# Altium project XBee_Explorer_Dongle.PrjPcb
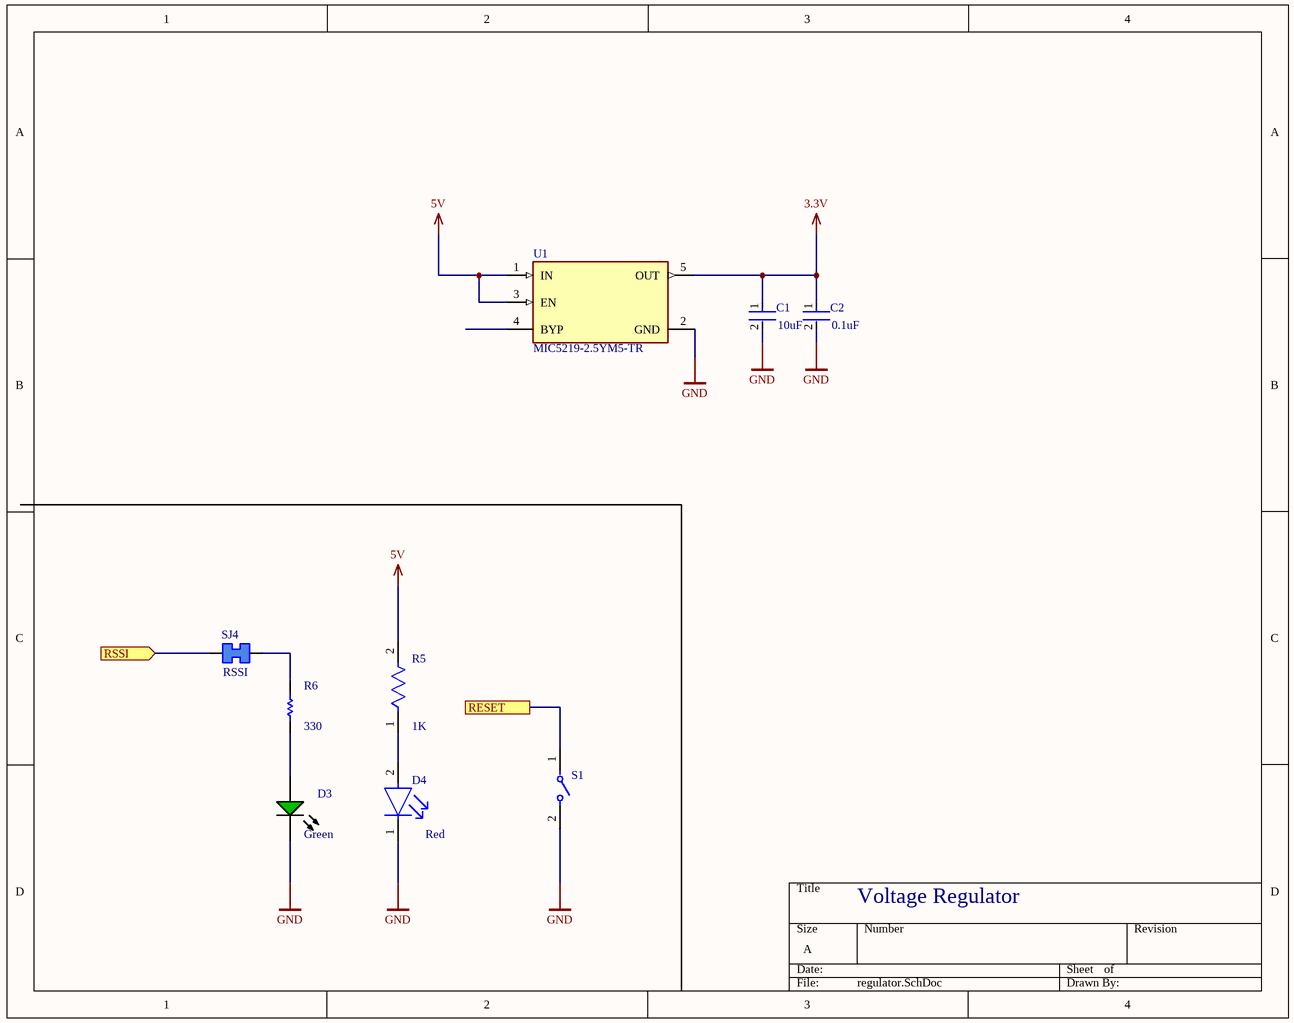
[diagram p0: regulator.SchDoc]
3 sheets, 29 parts. Net scope: flat (ports and power ports of the same name join across sheets).
Board file: PCB.PcbDoc
Sheets:
  regulator.SchDoc
  USB.SchDoc
  Xbee.SchDoc

## Sheet regulator.SchDoc
size A; SheetNumber: 1; SheetTotal: 3

### Parts
C1  10uF  [FP-GRM188-0_1-e0_2_0_55-IPC_A]
C2  0.1uF  [FP-C0402-BB-MFG]
D3  Green  [AVAG-HSMX-C170_V]
D4  Red  [FP-HSMS-C150-MFG]
R5  1K  [FP-ERJ1GN-IPC_C]
R6  330  [RESC0603X26X15ML03T05]
S1  (no value)  [FP-B3F-6022-MFG]
SJ4  RSSI  [Solder Jumper-Footprint-1]
U1  MIC5219-2.5YM5-TR  [FP-SOT23-5LD-PL-1-MFG]

### Ports
RESET, RSSI (in)

### Nets
3.3V: C1.1 C2.1 U1.5(OUT)
5V: R5.2 U1.1(IN) U1.3(EN)
GND: C1.2 C2.2 D3.2(K) D4.1(C) S1.2 U1.2(GND)
NetD3_1: D3.1(A) R6.2
NetD4_2: D4.2(A) R5.1
NetR6_1: R6.1 SJ4.2
NetS1_1: S1.1 ; port RESET
NetSJ4_1: SJ4.1 ; port RSSI

Not connected (* = marked no-connect by the designer): U1 4(BYP)

### Notes on the sheet
- Voltage Regulator

### Library data of the parts
C1 = CMP-2006-02792-2: Chip Multilayer Ceramic Capacitors for General Purpose, 0603, 10uF, X5R, 15%, 20%, 6.3V; Packaging: Tape and Reel; Voltage Rating (DC): 6.3V; Width: 0.031inch; Termination: SMD/SMT; Dielectric: X5R; Package Quantity: 4000; Voltage Rating: 6.3V; Capacitance: 10uF; Case/Package: 0603; Min Operating Temperature: -55°C; Voltage: 6.3V; Length: 1.6mm; Thickness: 0.035inch; Lead Free: Lead Free; Depth: 0.8mm; Case Code (Imperial): 0603; Max Operating Temperature: 85°C; Material: Ceramic; Height: 0.8mm; Tolerance: 20%; Mount: Surface Mount; REACH SVHC: No SVHC; Radiation Hardening: No; Case Code (Metric): 1608
C2 = CMP-2008-02046-2: CAP CER 0.1UF 10V X5R 0402; Manufacturer: Kemet; Manufacturer Part Number: C0402C104K8PACTU; Material: Ceramic; Capacitance: 0.10 μF; Temperature Coefficient: 15%; Tolerance: 0.1; Value: 0.10 μF; Package: C0402-BB; Temperature: -55°C to +125°C; ComponentLink2Description: Datasheet; Temperature Characteristic: X5R; Device Class L1: Passive Components; Height: 0.55mm; Lead Free: Yes; ComponentLink2URL: https://content.kemet.com/datasheets/KEM_C1002_X7R_SMD.pdf; Device Class L2: Capacitors; Temperature Range Low: -55°C; Temperature Range High: +125°C; RoHS: TRUE; Octopart: https://octopart.com/c0402c104k8pactu-kemet-140039; Automotive: No; Mouser Description: Capacitor 100 nF 10 VDC 0402; Category: Cap; Voltage Rating: 10 V; Digikey Description: CAP CER 0.1UF 10V X5R 0402; Ipc Land Pattern Name: CAPC10050X50; Device Class L3: Ceramic Capacitors
D3 = CMP-2000-05062-1: Chip LED, Green, 2.2 V, -40 to 85 degC, 2-Pin SMD, Pb-Free, Tape and Reel; Manufacturer: Avago; No. of Pins: 2; Peak Wavelength: 570nm; SVHC: NoSVHC(16-Jun-2014); Dominant Wavelength: 572nm; Forward Current If: 20mA; Viewing Angle: 170deg; Lens Shape: Rectangular; PIV Max: 5V; External Width: 1.25mm; LED Type: Standard; External Depth: 0.8mm; Opto Mounting Orientation: Top; Luminous Intensity: 15mcd; Luminous Intensity Min: 4mcd; Forward Voltage VF Max: 2.6V; External Length / Height: 2mm; Bulb Size: 1.25mmx1.4mm; Light Area Height: 1mm; Voltage Vf Typ: 2.2V; Operating Temperature Max: 85degC; Datasheet Version: Oct-08; MSL: MSL2A-4weeks; Peak Forward Current: 20mA; Package Description: 2-Pin Surface Mount Device, Body 2 x 1.25 mm, Height 0.8 mm; Datasheet URL: https://datasheet.ciiva.com/29280/180495-da-01-en-chip-led-hsmg-c170-gelb-gruen-29280971.pdf; Storage Temperature Min: -40degC; LED Colour: Green; Wavelength Typ: 570nm; Mounting Type: SMD; Forward Current If Max: 20mA; Dominant Wavelength Typ: 572nm; LED Mounting: SMD; Operating Temperature Range: -30degCto+85degC; Operating Temperature Min: -30degC; Manufacturer URL: http://www.avagotech.com/; Packaging: CutTape; Luminous Intensity Typ: 15mcd; Package Reference: HSMX-C170; Storage Temperature Max: 85degC; Opto Case Style: SMD; Forward Voltage: 2.2V
D4 = CMP-21615-000001-1: LED RED DIFFUSED CHIP SMD; Luminous Intensity: 10mcd; Power Dissipation: 65mW; Viewing Angle: 170°; Number of Elements: 1; Forward Current: 20mA; Lens Color: White; Lens Style: Rectangular; Wavelength: 626nm; Forward Voltage: 2.1V; Reverse Voltage: 5V; Number of Pins: 2; Color: Red; Lead Free: Lead Free; Width: 1.6mm; Length: 3.2mm; REACH SVHC: No SVHC; Height: 1.1mm; Depth: 1.6mm; Power Rating: 65mW; Package Quantity: 1; Illumination Color: Red; Radiation Hardening: No; Case Code (Imperial): 1206; Max Operating Temperature: 85°C; Test Current: 20mA; Case/Package: 1206; Lens Transparency: Diffused; Number of LEDs: 1; Packaging: Tape and Reel; Mount: Surface Mount; Min Operating Temperature: -40°C; Case Code (Metric): 3216; Dominant Wavelength: 626nm
R5 = CMP-1010-00416-3: RES SMD 1K OHM 1% 1/20W 0201; Temperature Coefficient: 200ppm/°C; Max Power Dissipation: 50mW; Voltage Rating (DC): 25V; Resistance: 1kR; Number of Pins: 2; Height: 0.01inch; Weight: 6E-06oz; Min Operating Temperature: -55°C; Features: Automotive AEC-Q200; Radiation Hardening: No; Resistor Type: Thick Film; RoHS Compliant: Yes; Termination: SMD/SMT; Package Quantity: 15000; Size Code: 0201; Case Code (Imperial): 0201; Resistance Tolerance: 1%; Contact Plating: Tin; Case/Package: 0201; Lead Free: Lead Free; Number of Terminations: 2; Tolerance: 1%; Max Operating Temperature: 125°C; Mount: Surface Mount; Width: 0.012inch; Series: ERJ; Voltage Rating: 25V; Power Rating: 50mW; Packaging: Tape and Reel; Length: 0.6mm; Case Code (Metric): 0603
R6 = CMP-2004-03502-1: Part Number: ERJ1GNF3300C; Manufacturer: Panasonic
S1 = CMP-08834-000012-1: SWITCH TACTILE SPST-NO 0.05A 24V; Switch Travel: 0.25mm; Actuator Type: Standard; Mechanical Life: 300000Cycles; Switch Function: Off-Mom; Illumination Type: Non-Illuminated; Operating Force: 1.47N; Throw Configuration: SPST; Case/Package: Radial; Contact Plating: Gold; Termination: PC Pins; Max Voltage Rating (DC): 24V; Packaging: Ammo Pack; Min Operating Temperature: -25°C; Mount: Through Hole; Package Quantity: 1000; Max Operating Temperature: 70°C
SJ4 = CMP-00030-00001-2: 2 pad Solder Jumper
U1 = CMP-00252-66802246-1: MIC5219-2.5YM5-TR LDO Regulator Pos 2.5V 0.5A 5-Pin SOT-23 T/R; Max Junction Temperature (Tj): 125°C; Dropout Voltage: 350mV; Output Type: Fixed; Accuracy: 1%; Number of Regulators: 1; Max Input Voltage: 12V; Output Current: 500mA; Min Supply Voltage: 3.5V; Polarity: Positive; Packaging: Tape and Reel; Height: 1.1mm; RoHS: Compliant; NexarPartId: 66802246; Number of Pins: 5; Lifecycle Status: Production; Lead Free: Lead Free; Output Voltage Accuracy: 1%; Schedule B: 8542390000; Case/Package: SOT-23; Output Voltage: 2.5V; REACH SVHC: No SVHC; Max Operating Temperature: 125°C; Mount: Surface Mount; Width: 1.6mm; Nominal Output Voltage: 2.5V; Min Input Voltage: 2.5V; Length: 2.9mm; Min Output Voltage: 2.5V; Max Supply Voltage: 12V; Ambient Temperature Range High: 125°C; Number of Outputs: 1; Min Operating Temperature: -40°C; Max Output Current: 500mA

## Sheet USB.SchDoc
size A; SheetNumber: 2; SheetTotal: 3
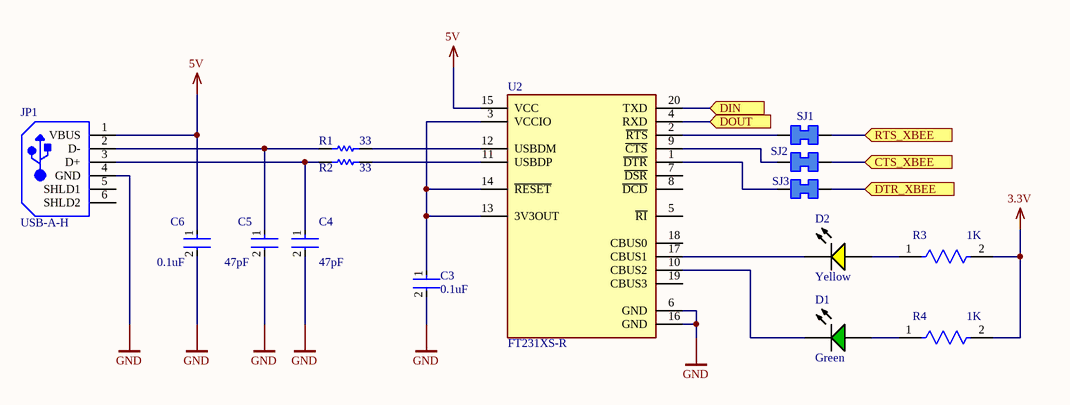
[diagram p1: USB.SchDoc]

### Parts
C3  0.1uF  [FP-C0402-BB-MFG]
C4  47pF  [FP-C0805C-DN-MFG]
C5  47pF  [FP-C0805C-DN-MFG]
C6  0.1uF  [FP-C0402-BB-MFG]
D1  Green  [AVAG-HSMX-C170_V]
D2  Yellow  [AVAG-HSMX-C190_V]
JP1  USB-A-H  [TE-292303-1_V]
R1  33  [RESC0603X26X15ML03T05]
R2  33  [RESC0603X26X15ML03T05]
R3  1K  [FP-ERJ1GN-IPC_C]
R4  1K  [FP-ERJ1GN-IPC_C]
SJ1  Solder Jumper  [Solder Jumper-Footprint-1]  (value not drawn)
SJ2  Solder Jumper  [Solder Jumper-Footprint-1]  (value not drawn)
SJ3  Solder Jumper  [Solder Jumper-Footprint-1]  (value not drawn)
U2  FT231XS-R  [FP-SSOP-20-MFG]

### Ports
CTS_XBEE (in), DIN (in), DOUT (in), DTR_XBEE (in), RTS_XBEE (in)

### Nets
3.3V: R3.2 R4.2
5V: C6.1 JP1.1(VBUS) U2.15(VCC)
GND: C3.2 C4.2 C5.2 C6.2 JP1.4(GND) U2.6(GND) U2.16(GND)
NetC3_1: C3.1 U2.3(VCCIO) U2.13(3V3OUT) U2.14(~{RESET})
NetC4_1: C4.1 JP1.3(D+) R2.1
NetC5_1: C5.1 JP1.2(D-) R1.1
NetD1_1: D1.1(A) R4.1
NetD1_2: D1.2(K) U2.10(CBUS2)
NetD2_1: D2.1(A) R3.1
NetD2_2: D2.2(K) U2.17(CBUS1)
NetR1_2: R1.2 U2.12(USBDM)
NetR2_2: R2.2 U2.11(USBDP)
NetSJ1_1: SJ1.1 U2.2(~{RTS})
NetSJ1_2: SJ1.2 ; port RTS_XBEE
NetSJ2_1: SJ2.1 U2.9(~{CTS})
NetSJ2_2: SJ2.2 ; port CTS_XBEE
NetSJ3_1: SJ3.1 U2.1(~{DTR})
NetSJ3_2: SJ3.2 ; port DTR_XBEE
NetU2_4: U2.4(RXD) ; port DOUT
NetU2_20: U2.20(TXD) ; port DIN

Not connected (* = marked no-connect by the designer): JP1 5(SHLD1) 6(SHLD2); U2 5(~{RI}) 7(~{DSR}) 8(~{DCD}) 18(CBUS0) 19(CBUS3)

### Library data of the parts
C3 C6 = CMP-2008-02046-2: as C2 on sheet regulator; Package: C0402-BB; Temperature: -55°C to +125°C; ComponentLink2Description: Datasheet; Temperature Characteristic: X5R; Device Class L1: Passive Components; Height: 0.55mm; Lead Free: Yes; ComponentLink2URL: https://content.kemet.com/datasheets/KEM_C1002_X7R_SMD.pdf; Device Class L2: Capacitors; Temperature Range Low: -55°C; Temperature Range High: +125°C; RoHS: TRUE; Octopart: https://octopart.com/c0402c104k8pactu-kemet-140039; Automotive: No; Mouser Description: Capacitor 100 nF 10 VDC 0402; Category: Cap; Voltage Rating: 10 V; Digikey Description: CAP CER 0.1UF 10V X5R 0402; Ipc Land Pattern Name: CAPC10050X50; Device Class L3: Ceramic Capacitors
C4 C5 = CMP-2007-00435-2: CAP CER 47PF 50V C0G/NP0 0805; Manufacturer: KEMET; Manufacturer Part Number: C0805C470J5GACTU; Temperature Characteristic: C0G; Material: Ceramic; Temperature Coefficient: 30ppm/°C; Tolerance: 0.05; Temperature Range High: +125°C; Device Class L1: Passive Components; Device Class L3: Ceramic Capacitors; Lead Free: Yes; Temperature: -55°C to +125°C; Capacitance: 47 pF; Height: 0.88mm; Octopart: https://octopart.com/c0805c470j5gactu-kemet-150274; RoHS: TRUE; Category: Cap; Voltage Rating: 50 V; Automotive: No; Device Class L2: Capacitors; Value: 47 pF; Ipc Land Pattern Name: CAPC200125X78; Temperature Range Low: -55°C; Mouser Description: Multilayer Ceramic Capacitors MLCC - SMD/SMT 50volts 47pF C0G 5%; Package: C0805C-DN; Digikey Description: CAP CER 47PF 50V C0G/NP0 0805; ComponentLink2URL: https://content.kemet.com/datasheets/KEM_C1003_C0G_SMD.pdf; ComponentLink2Description: Datasheet
D1 = CMP-2000-05062-1: as D3 on sheet regulator; Operating Temperature Max: 85degC; Datasheet Version: Oct-08; MSL: MSL2A-4weeks; Peak Forward Current: 20mA; Package Description: 2-Pin Surface Mount Device, Body 2 x 1.25 mm, Height 0.8 mm; Datasheet URL: https://datasheet.ciiva.com/29280/180495-da-01-en-chip-led-hsmg-c170-gelb-gruen-29280971.pdf; Storage Temperature Min: -40degC; LED Colour: Green; Wavelength Typ: 570nm; Mounting Type: SMD; Forward Current If Max: 20mA; Dominant Wavelength Typ: 572nm; LED Mounting: SMD; Operating Temperature Range: -30degCto+85degC; Operating Temperature Min: -30degC; Manufacturer URL: http://www.avagotech.com/; Packaging: CutTape; Luminous Intensity Typ: 15mcd; Package Reference: HSMX-C170; Storage Temperature Max: 85degC; Opto Case Style: SMD; Forward Voltage: 2.2V
D2 = CMP-1744-00003-1: LED Uni-Color Yellow, 65 mW, 20 mA, -40 to 85 degC, 2-Pin SMD, RoHS, Tape and Reel; Tolerance: 1%; Voltage Rating: 50 V; Power Rating: 100 mW; Case\Package: 0603; Resistance: 390 Ohm; Min Operating Temperature: -55 degC; Length: 1.6 mm; ComponentLink3Description: Package Specification; Mount: Surface Mount; PackageReference: HSMX-C190; ComponentLink2Description: Datasheet; DatasheetVersion: Mar-12; Case Code (Metric): 1608; Pins: 2; Package Quantity: 5000; ComponentLink2URL: http://docs.avagotech.com/docs/AV02-0551EN; ComponentLink1Description: Manufacturer URL; RoHSCompliant: true; Packaging: Tape and Reel; PackageDescription: 2-Pin Surface Mount Device, Body 1.6 x 0.8 mm, Height 0.9 mm; REACH SVHC: No SVHC; ComponentLink3URL: http://www.fairchildsemi.com/dwg/MA/MA03D.pdf; Voltage Rating (DC): 50 V; Width: 0.8 mm; ComponentLink1URL: http://www.avagotech.com/; Max Operating Temperature: 155 degC; Case Code (Imperial): 0603; Height: 0.45 mm
JP1 = CMP-2000-05404-1: 1 Port Right Angle Through Hole Mount Female Type A USB Connector, 4 Position, -55 to 85 degC, RoHS, Tube; Manufacturer: TE Connectivity; Contact Termination Type: Solder; No. of Contacts: 4; Connector Mounting: PCB; SVHC: NoSVHC(16-Jun-2014); Gender: Receptacle; Connector Type: USBA; Package Description: 4-Pin Through Hole Device, Body 14 x 13.13 mm, Pitch 2.5 mm; Contact Plating: Gold; Package Reference: 292303-1; Contact Material: Copper; Datasheet URL: http://www.farnell.com/cad/1653030.pdf; Datasheet Version: Feb-12; Manufacturer URL: http://www.te.com/
R1 R2 = CMP-2004-03506-1: Manufacturer: Panasonic; Part Number: ERJ1GNF33R0C
R3 R4 = CMP-1010-00416-3: as R5 on sheet regulator; Number of Pins: 2; Height: 0.01inch; Weight: 6E-06oz; Min Operating Temperature: -55°C; Features: Automotive AEC-Q200; Radiation Hardening: No; Resistor Type: Thick Film; RoHS Compliant: Yes; Termination: SMD/SMT; Package Quantity: 15000; Size Code: 0201; Case Code (Imperial): 0201; Resistance Tolerance: 1%; Contact Plating: Tin; Case/Package: 0201; Lead Free: Lead Free; Number of Terminations: 2; Tolerance: 1%; Max Operating Temperature: 125°C; Mount: Surface Mount; Width: 0.012inch; Series: ERJ; Voltage Rating: 25V; Power Rating: 50mW; Packaging: Tape and Reel; Length: 0.6mm; Case Code (Metric): 0603
SJ1-SJ3 = CMP-00030-00001-2: 2 pad Solder Jumper
U2 = CMP-0248-00024-3: IC USB SERIAL FULL UART 20SSOP; Operating Supply Voltage: 5V; Operating Supply Current: 8mA; Number of Channels: 1; Min Supply Voltage: 2.97V; Max Supply Voltage: 5.5V; Data Rate: 12Mbps; Height: 0.059inch; Packaging: Tape and Reel; Mount: Surface Mount; Package Quantity: 2000; Radiation Hardening: No; Case/Package: SSOP; Min Operating Temperature: -40°C; Width: 0.157inch; Number of Pins: 20; Weight: 0.016oz; Interface: UART; Max Operating Temperature: 85°C; Length: 8.74mm

## Sheet Xbee.SchDoc
size A; SheetNumber: 3; SheetTotal: 3
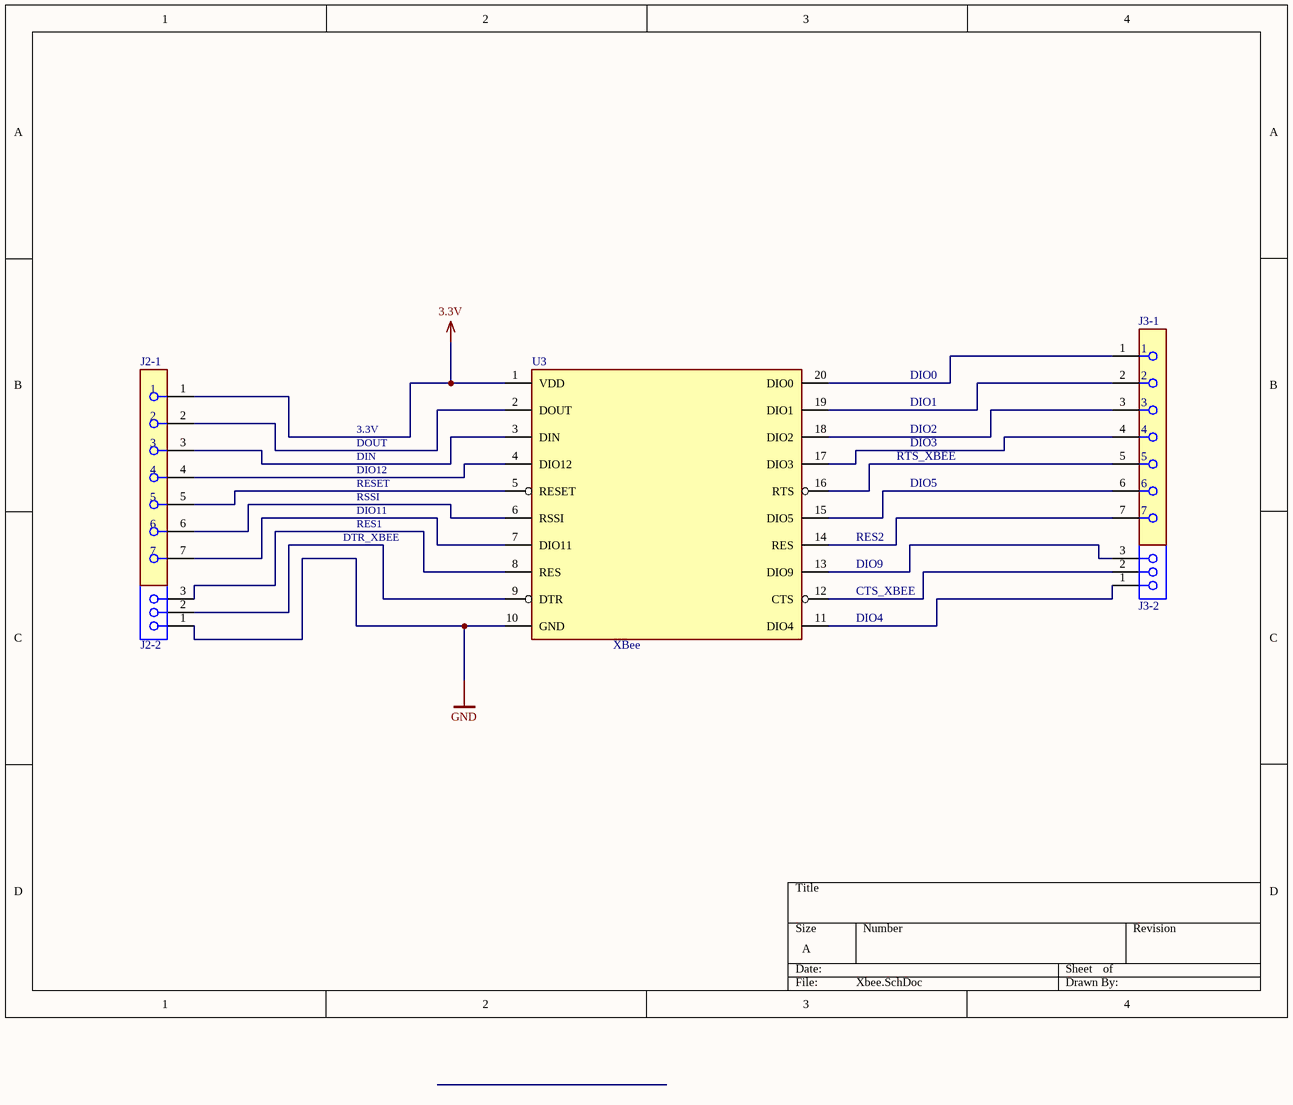
[diagram p2: Xbee.SchDoc]

### Parts
J2-1  SSM-107-L-SV-BE  [FP-SSM-107-L-SV-BE-MFG]  (value not drawn)
J2-2  SSM-103-L-SV  [SMTC-SSM-103-X-SV]  (value not drawn)
J3-1  SSM-107-L-SV-BE  [FP-SSM-107-L-SV-BE-MFG]  (value not drawn)
J3-2  SSM-103-L-SV  [SMTC-SSM-103-X-SV]  (value not drawn)
U3  XBee  [FP-XBP9B-DMUTB002-MFG]

### Nets
3.3V: J2-1.1 U3.1(VDD)
GND: J2-2.1 U3.10(GND)
NetJ2-1_2: J2-1.2 U3.2(DOUT)
NetJ2-1_3: J2-1.3 U3.3(DIN)
NetJ2-1_4: J2-1.4 U3.4(DIO12)
NetJ2-1_5: J2-1.5 U3.5(RESET)
NetJ2-1_6: J2-1.6 U3.6(RSSI)
NetJ2-1_7: J2-1.7 U3.7(DIO11)
NetJ2-2_2: J2-2.2 U3.9(DTR)
NetJ2-2_3: J2-2.3 U3.8(RES)
NetJ3-1_1: J3-1.1 U3.20(DIO0)
NetJ3-1_2: J3-1.2 U3.19(DIO1)
NetJ3-1_3: J3-1.3 U3.18(DIO2)
NetJ3-1_4: J3-1.4 U3.17(DIO3)
NetJ3-1_5: J3-1.5 U3.16(RTS)
NetJ3-1_6: J3-1.6 U3.15(DIO5)
NetJ3-1_7: J3-1.7 U3.14(RES)
NetJ3-2_1: J3-2.1 U3.11(DIO4)
NetJ3-2_2: J3-2.2 U3.12(CTS)
NetJ3-2_3: J3-2.3 U3.13(DIO9)

### Notes on the sheet
- 3.3V
- DIO0
- DIO1
- DIO2
- DOUT
- DIN
- DIO12
- RESET
- RSSI
- RTS_XBEE
- DIO3
- DIO5
- DTR_XBEE
- DIO11
- RES1
- RES2
- DIO9
- CTS_XBEE
- DIO4

### Library data of the parts
J2-1 J3-1 = CMP-02766-001731-1: CONN RCPT 7POS 0.1 GOLD SMD; Connector Type: Receptacle; Max Current Rating: 6.9A; Number of Positions: 7; Pitch: 2.54mm; Voltage Rating (AC): 405V; Voltage Rating (DC): 572V; Max Voltage Rating (AC): 475V; Contact Resistance: 10mR; Gender: Female; Series: SSM; Max Operating Temperature: 125°C; Number of Rows: 1; Contact Finish - Mating: GOLD; Radiation Hardening: No; Housing Color: Black; Orientation: Straight; Min Operating Temperature: -55°C; Length: 17.78mm; RoHS Compliant: Yes; Termination: Solder; Housing Material: Polymer; Insulation Color: Black; Number of Contacts: 7; Contact Shape: Square; Contact Plating: Gold; Insulation Material: Polymer; Depth: 2.54mm; Contact Material: Bronze; Packaging: Rail/Tube; Contact Type: Female Socket; Lead Free: Lead Free; Fastening Type: Pull
J2-2 J3-2 = CMP-1023-00201-1: Tiger Claw(TM) Surface Mount Socket, Vertical, -55 to 125 degC, 2.54 mm Pitch, 3-Pin, Female, RoHS; Manufacturer: Samtec; Pitch: 2.54 mm; Orientation: Vertical; Temperature Range: -55 to 125 degC; ComponentLink2URL: http://www.samtec.com/documents/webfiles/pdf/SSM_SM.PDF; DatasheetVersion: F-214; PackageDescription: .100 C.L. Surface Mount Socket Strip; PackageVersion: CR, 9/1998; ComponentLink1Description: Manufacturer URL; PackageReference: SSM-103-X-SV; ComponentLink3URL: http://www.samtec.com/documents/webfiles/cpdf/SSM-1XX-XXX-XX-XX-XX-X-XX-XX-MKT.pdf; RoHS: True; ComponentLink2Description: Datasheet; ComponentLink1URL: http://www.samtec.com; Mounting Technology: Surface Mount; ComponentLink3Description: Package Specification; PartNumber: SSM-103-L-SV
U3 = CMP-84319-000004-1: RX TXRX MOD ISM < 1GHZ U.FL TH; Max Supply Voltage: 3.6V; Current - Transmitting: 215mA; Sensitivity: -101dBm; Min Frequency: 902MHz; Memory Size: 2KB; Max Frequency: 928MHz; Min Supply Voltage: 2.4V; Current - Receiving: 29mA; Interface: SPI; Data Rate: 200Kbps; Frequency: 900MHz; Output Power (dBm): 24dBm; Number of Pins: 20; Series: XBee-Pro™; Max Operating Temperature: 85°C; Radiation Hardening: No; Min Operating Temperature: -40°C; Package Quantity: 1; RAM Size: 2KB; Packaging: Bulk; Case/Package: Module

## Nets that join several sheets
3.3V: regulator (C1.1 C2.1 U1.5), USB (R3.2 R4.2), Xbee (J2-1.1 U3.1)
5V: regulator (R5.2 U1.1 U1.3), USB (C6.1 JP1.1 U2.15)
GND: regulator (6 pins), USB (7 pins), Xbee (J2-2.1 U3.10)